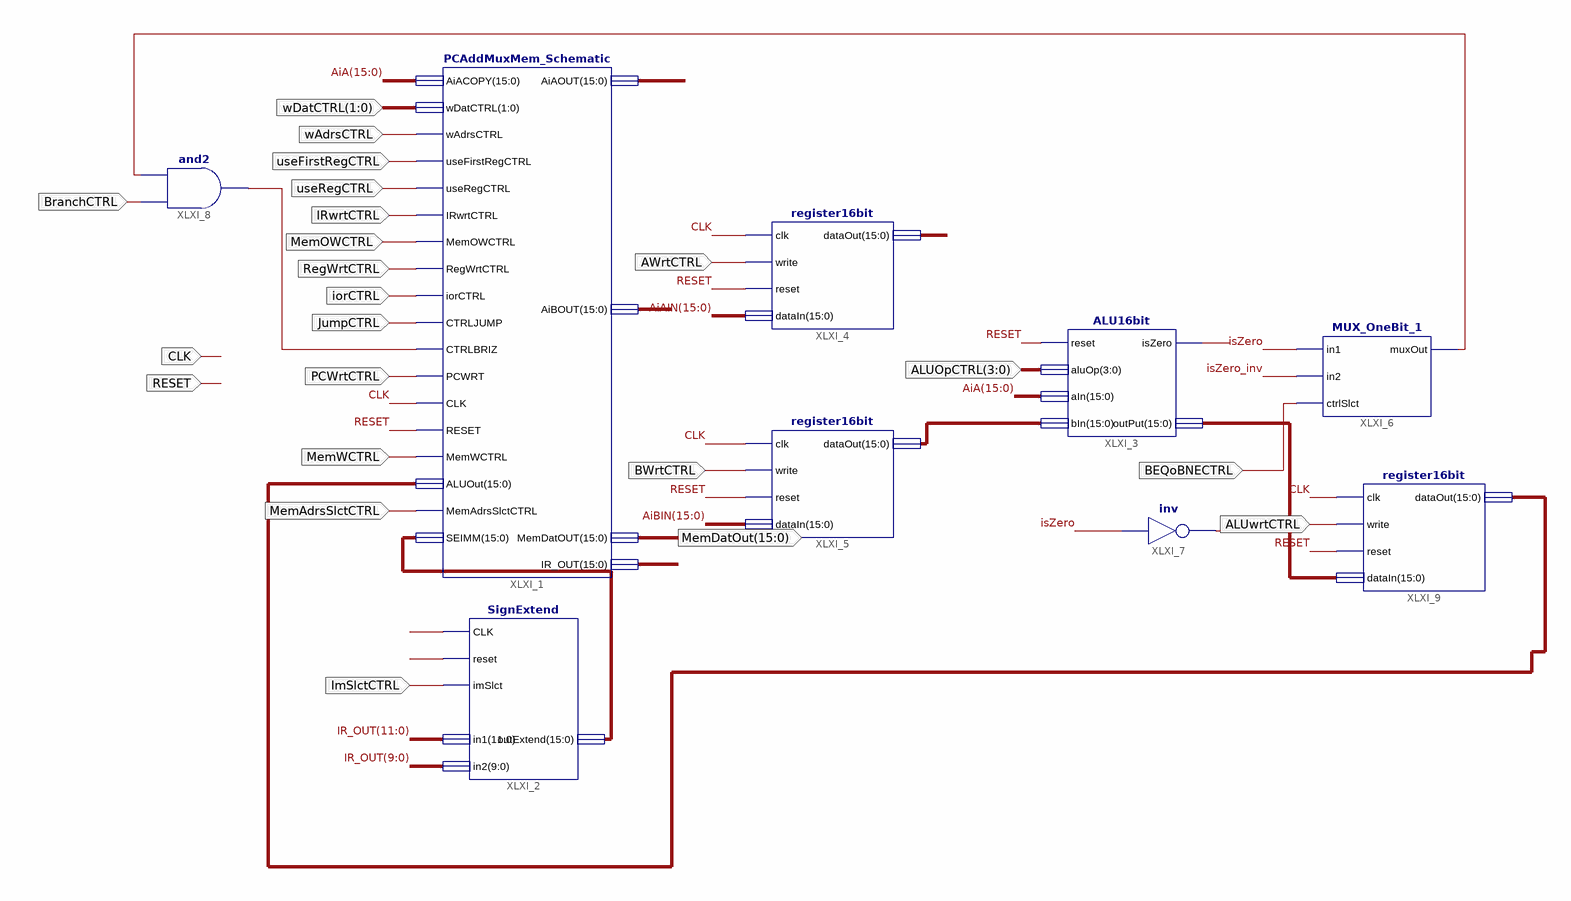
[diagram p0: schematic sheet 1]
// Xilinx ISE schematic EverythingButALU_Schematic.sch (spartan3e) as structural Verilog: 9 symbols, 22 ports
module EverythingButALU_Schematic (
  input  BWrtCTRL,
  input  AWrtCTRL,
  input  [3:0] ALUOpCTRL,
  input  ImSlctCTRL,
  input  CLK,
  input  RESET,
  input  MemAdrsSlctCTRL,
  input  MemWCTRL,
  input  PCWrtCTRL,
  input  JumpCTRL,
  input  iorCTRL,
  input  RegWrtCTRL,
  input  MemOWCTRL,
  input  IRwrtCTRL,
  input  useRegCTRL,
  input  useFirstRegCTRL,
  input  wAdrsCTRL,
  input  [1:0] wDatCTRL,
  input  BEQoBNECTRL,
  input  BranchCTRL,
  input  ALUwrtCTRL,
  output [15:0] MemDatOut
);

  wire isZero, isZero_inv, XLXN_22, XLXN_23, XLXN_58, XLXN_61;
  wire [15:0] AiA, AiAIN, AiBIN, IR_OUT, XLXN_11, XLXN_28, XLXN_37, XLXN_66;

  PCAddMuxMem_Schematic XLXI_1 (
    .AiACOPY(AiA), .wDatCTRL(wDatCTRL), .wAdrsCTRL(wAdrsCTRL), .useFirstRegCTRL(useFirstRegCTRL),
    .useRegCTRL(useRegCTRL), .IRwrtCTRL(IRwrtCTRL), .MemOWCTRL(MemOWCTRL), .RegWrtCTRL(RegWrtCTRL),
    .iorCTRL(iorCTRL), .CTRLJUMP(JumpCTRL), .CTRLBRIZ(XLXN_58), .PCWRT(PCWrtCTRL), .CLK(CLK), .RESET(RESET),
    .MemWCTRL(MemWCTRL), .ALUOut(XLXN_37), .MemAdrsSlctCTRL(MemAdrsSlctCTRL), .SEIMM(XLXN_28),
    .AiAOUT(AiAIN), .AiBOUT(AiBIN), .MemDatOUT(MemDatOut), .IR_OUT(IR_OUT));
  SignExtend XLXI_2 (
    .CLK(XLXN_22), .reset(XLXN_23), .imSlct(ImSlctCTRL), .in1(IR_OUT[11:0]), .in2(IR_OUT[9:0]),
    .outExtend(XLXN_28));
  ALU16bit XLXI_3 (.reset(RESET), .aluOp(ALUOpCTRL), .aIn(AiA), .bIn(XLXN_11), .isZero(isZero), .outPut(XLXN_66));
  register16bit XLXI_4 (.clk(CLK), .write(AWrtCTRL), .reset(RESET), .dataIn(AiAIN), .dataOut(AiA));
  register16bit XLXI_5 (.clk(CLK), .write(BWrtCTRL), .reset(RESET), .dataIn(AiBIN), .dataOut(XLXN_11));
  MUX_OneBit_1 XLXI_6 (.in1(isZero), .in2(isZero_inv), .ctrlSlct(BEQoBNECTRL), .muxOut(XLXN_61));
  not XLXI_7 (isZero_inv, isZero);
  and XLXI_8 (XLXN_58, BranchCTRL, XLXN_61);
  register16bit XLXI_9 (.clk(CLK), .write(ALUwrtCTRL), .reset(RESET), .dataIn(XLXN_66), .dataOut(XLXN_37));
endmodule
